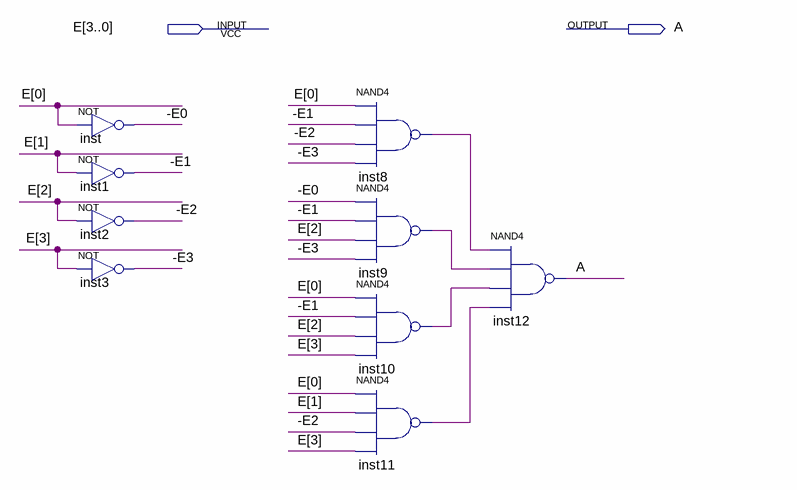
[diagram p0: schematic sheet]
// Quartus schematic ledA.bdf as structural Verilog: 9 symbols, 2 pins
module ledA (
  input  [3:0] E,
  output A
);

  wire \-E0 , \-E1 , \-E2 , \-E3 , inst8_out, inst9_out, inst10_out, inst11_out;

  not inst (\-E0 , E[0]);
  not inst1 (\-E1 , E[1]);
  not inst2 (\-E2 , E[2]);
  not inst3 (\-E3 , E[3]);
  nand inst8 (inst8_out, E[0], \-E1 , \-E2 , \-E3 );
  nand inst9 (inst9_out, \-E0 , \-E1 , E[2], \-E3 );
  nand inst10 (inst10_out, E[0], \-E1 , E[2], E[3]);
  nand inst11 (inst11_out, E[0], E[1], \-E2 , E[3]);
  nand inst12 (A, inst8_out, inst9_out, inst10_out, inst11_out);
endmodule
